# EAGLE design untitled (EAGLE 9.6.2)
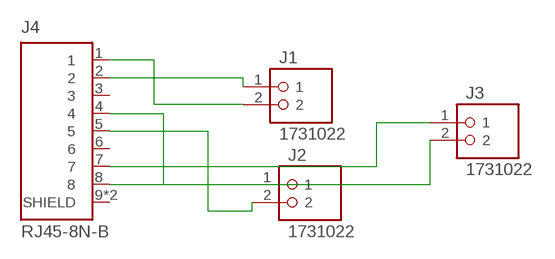
[diagram p0: schematic, sheet 1]

## Parts
J1  1731022  [PHOENIX_1731022]
J2  1731022  [PHOENIX_1731022]
J3  1731022  [PHOENIX_1731022]
J4  RJ45-8N-B  [TE_RJ45-8N-B]

## Nets
N$3: J1.1 J4.2
N$4: J1.2 J4.1
N$5: J2.1 J4.4
N$6: J2.2 J4.5
N$7: J3.1 J4.7
N$8: J3.2 J4.8
Unconnected: J4.3 J4.6 J4.9(SHIELD) J4.10(SHIELD)

## Library data of the parts
J1-J3 = terminal block 7.5mm:1731022: Check availability <https://pricing.snapeda.com/parts/1731022/Phoenix%20Contact/view-part?ref=eda>; AVAILABILITY: In Stock; CHECK_PRICES: https://www.snapeda.com/parts/1731022/Phoenix+Contact/view-part/?ref=eda; DESCRIPTION: PCB Terminal Screw 7.5mm 12AWG 630V 24A 2 Position Combicon Control Series | Phoenix Contact 1731022; MF: Phoenix Contact; MP: 1731022; PACKAGE: None; PRICE: None; SNAPEDA_LINK: https://www.snapeda.com/parts/1731022/Phoenix+Contact/view-part/?ref=snap
J4 = ethernet socket:RJ45-8N-B: Check availability <https://pricing.snapeda.com/parts/RJ45-8N-B/TE%20Connectivity/view-part?ref=eda>; AVAILABILITY: In Stock; CHECK_PRICES: https://www.snapeda.com/parts/RJ45-8N-B/TE+Connectivity+Corcom+Filters/view-part/?ref=eda; DESCRIPTION: Corcom FILTER SIGNAL LINE MODULAR 8CONTACTS 1 PORT THROUGH HOLE | TE Connectivity RJ45-8N-B; MF: TE Connectivity; MP: RJ45-8N-B; PACKAGE: None; PRICE: None; SNAPEDA_LINK: https://www.snapeda.com/parts/RJ45-8N-B/TE+Connectivity+Corcom+Filters/view-part/?ref=snap

## Board
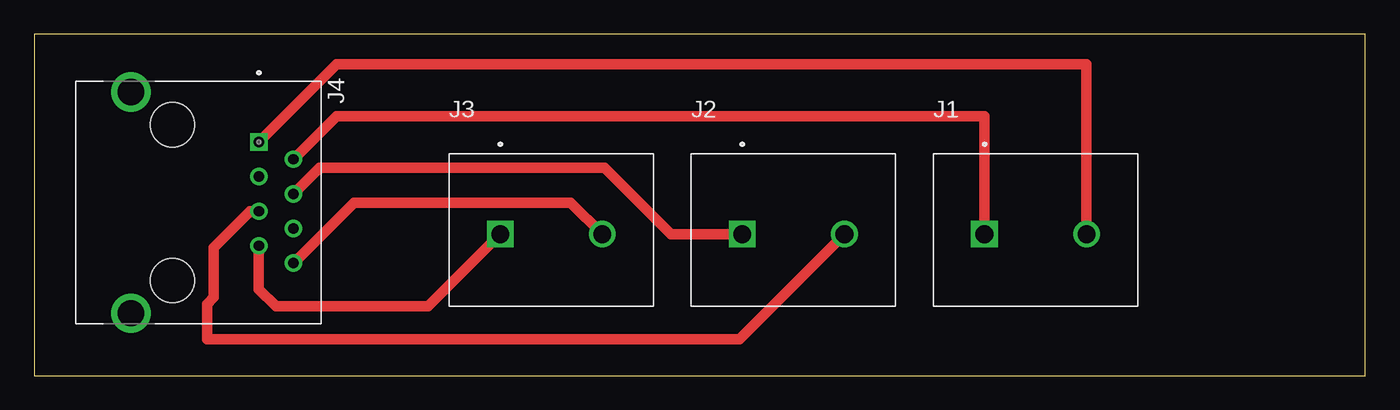
[diagram p1: board, top side]

Size 97.77 x 25.07 mm. Coordinates in mm from the lower left corner, seen from the top.
Outline: 0,0 97.77,0 97.77,25.07 0,25.07 0,0
Copper layers (1*16): Top 0.035mm / dielectric 1.5mm / Bottom 0.035mm
Design rules "default": minimum track width 6mil, minimum drill 0.35mm, track to track 6mil, track to pad 6mil, pad to pad 6mil, via to via 6mil, smd to smd 6mil, copper to edge 40mil, drill to drill 6mil, minimum pad ring 10mil, minimum via ring 8mil, stop-mask expansion 4mil, vias tented up to drill 0mil, thermal gap 10mil

### Footprints (pad centres in the part's own frame; a part is rotated, then mirrored left to right if it is on the bottom)
PHOENIX_1731022 = drill 1.3 square: 1 3.75,5.3 | drill 1.3: 2 11.25,5.3
TE_RJ45-8N-B = drill 0.76 square: 1 -4.445,6.35 | drill 0.76: 2 -3.175,8.89; 3 -1.905,6.35; 4 -0.635,8.89; 5 0.635,6.35; 6 1.905,8.89; 7 3.175,6.35; 8 4.445,8.89 | drill 1.93: 9 -8.125,-3.05; 10 8.125,-3.05 | hole 3.25: -5.715,0; 5.715,0

### Placement (x,y rotation side)
J1  66.04,5.08 0 top
J2  48.26,5.08 0 top
J3  30.48,5.08 0 top
J4  10.16,12.7 270 top

### Tracks (layer width: path | path; a pad name or v marks a point on that pad's centre or on a via)
N$3
  Top 0.762: J1.1 69.79,19.05 22.23,19.05 J4.2
N$4
  Top 0.762: J1.2 77.29,22.86 22.23,22.86 J4.1
N$5
  Top 0.762: J2.1 46.77,10.38 41.91,15.24 20.96,15.24 J4.4
N$6
  Top 0.762: J2.2 51.8,2.67 12.7,2.67 12.7,5.25 13.18,5.73 13.18,9.37 15.88,12.06 J4.5
N$7
  Top 0.762: J3.1 28.93,5.08 17.78,5.08 16.51,6.35 J4.7
N$8
  Top 0.762: J3.2 39.41,12.7 23.5,12.7 J4.8